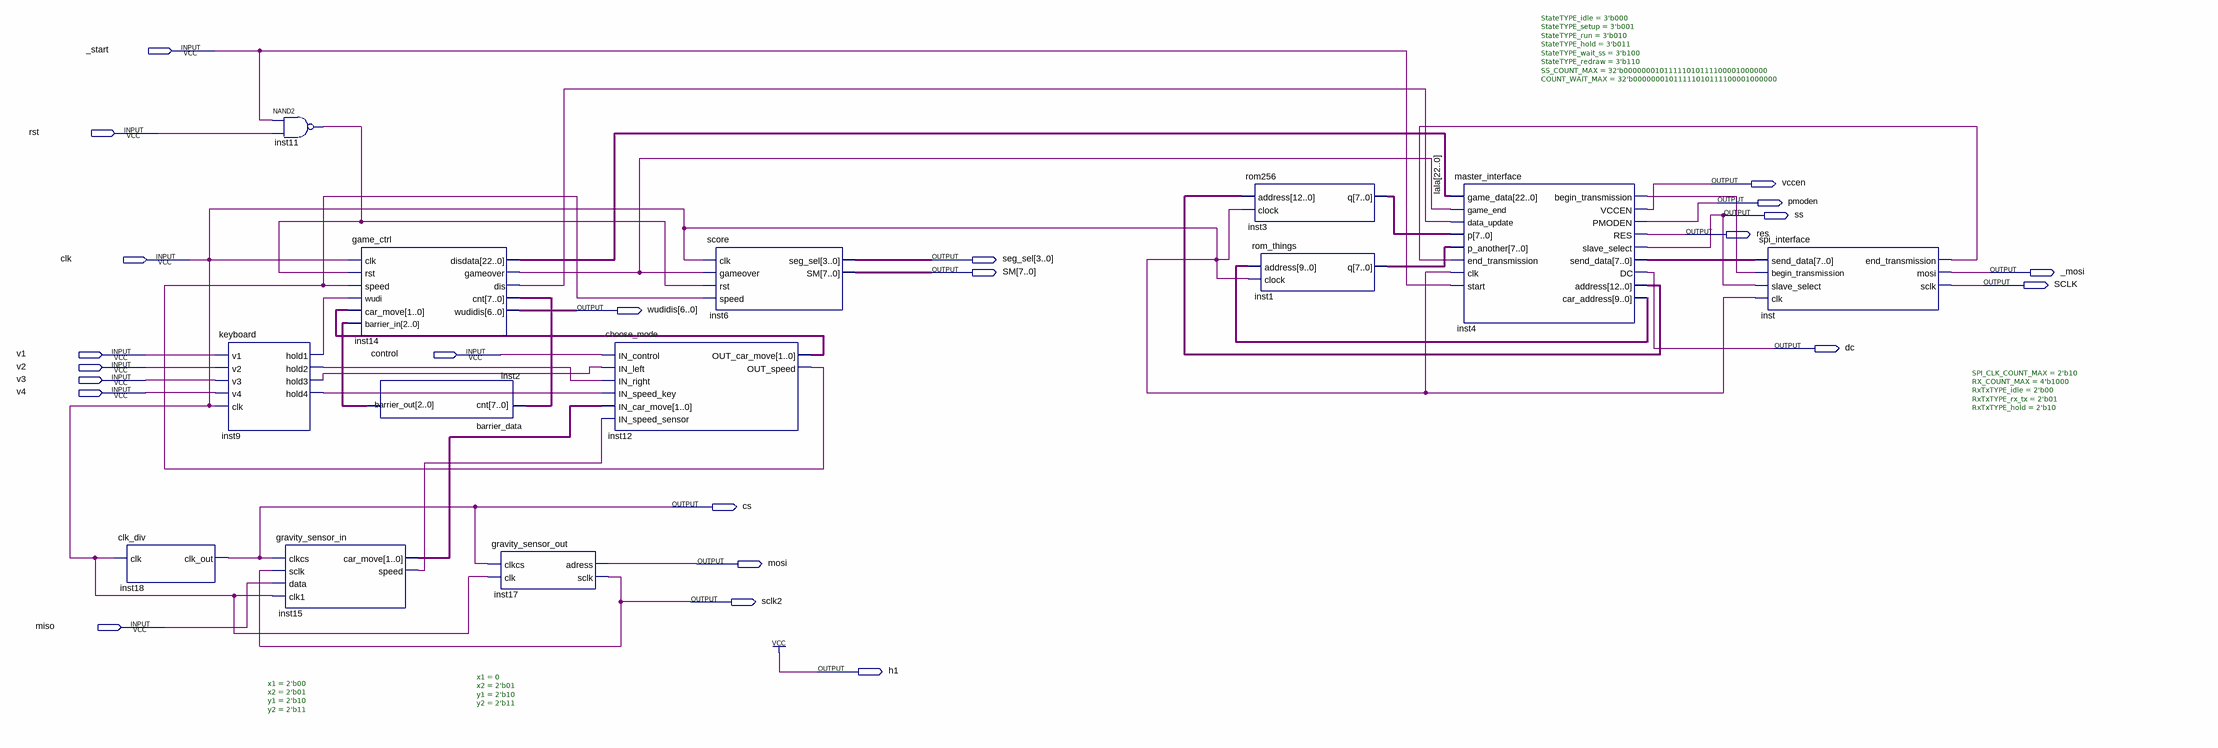
[diagram p0: schematic sheet]
// Quartus schematic mission3 (2).bdf as structural Verilog: 13 symbols, 23 pins
module \mission3_(2)  (
  input  _start,
  input  rst,
  input  clk,
  input  v1,
  input  control,
  input  v2,
  input  v3,
  input  v4,
  input  miso,
  output vccen,
  output pmoden,
  output ss,
  output res,
  output [3:0] seg_sel,
  output [7:0] SM,
  output _mosi,
  output SCLK,
  output [6:0] wudidis,
  output dc,
  output cs,
  output mosi,
  output sclk2,
  output h1
);

  wire inst4_begin_transmission, inst9_hold1, inst9_hold2, inst9_hold3, inst9_hold4, inst11_out,
       inst12_out_speed, inst14_dis, inst14_gameover, inst15_speed, inst_end_transmission;
  wire [1:0] inst12_out_car_move, inst15_car_move;
  wire [2:0] inst2_barrier_out;
  wire [7:0] inst1_q, inst3_q, inst4_send_data, inst14_cnt;
  wire [9:0] inst4_car_address;
  wire [12:0] inst4_address;
  wire [22:0] lala;

  clk_div inst18 (.clk(clk), .clk_out(cs));
  keyboard inst9 (
    .v1(v1), .v2(v2), .v3(v3), .v4(v4), .clk(clk), .hold1(inst9_hold1), .hold2(inst9_hold2),
    .hold3(inst9_hold3), .hold4(inst9_hold4));
  nand inst11 (inst11_out, _start, rst);
  gravity_sensor_in #(.x1(2'b00), .x2(2'b01), .y1(2'b10), .y2(2'b11)) inst15 (
    .clkcs(cs), .sclk(sclk2), .data(miso), .clk1(clk), .car_move(inst15_car_move), .speed(inst15_speed));
  game_ctrl inst14 (
    .clk(clk), .rst(inst11_out), .speed(inst12_out_speed), .wudi(inst9_hold1),
    .car_move(inst12_out_car_move), .barrier_in(inst2_barrier_out), .disdata(lala),
    .gameover(inst14_gameover), .dis(inst14_dis), .cnt(inst14_cnt), .wudidis(wudidis));
  barrier_data inst2 (.cnt(inst14_cnt), .barrier_out(inst2_barrier_out));
  gravity_sensor_out #(.x1(0), .x2(2'b01), .y1(2'b10), .y2(2'b11)) inst17 (
    .clkcs(cs), .clk(clk), .adress(mosi), .sclk(sclk2));
  choose_mode inst12 (
    .IN_control(control), .IN_left(inst9_hold3), .IN_right(inst9_hold2), .IN_speed_key(inst9_hold4),
    .IN_car_move(inst15_car_move), .IN_speed_sensor(inst15_speed), .OUT_car_move(inst12_out_car_move),
    .OUT_speed(inst12_out_speed));
  score inst6 (
    .clk(clk), .gameover(inst14_gameover), .rst(inst11_out), .speed(inst12_out_speed), .seg_sel(seg_sel),
    .SM(SM));
  rom256 inst3 (.address(inst4_address), .clock(clk), .q(inst3_q));
  rom_things inst1 (.address(inst4_car_address), .clock(clk), .q(inst1_q));
  master_interface #(.StateTYPE_idle(3'b000), .StateTYPE_setup(3'b001), .StateTYPE_run(3'b010), .StateTYPE_hold(3'b011), .StateTYPE_wait_ss(3'b100), .StateTYPE_redraw(3'b110), .SS_COUNT_MAX(32'b00000001011111010111100001000000), .COUNT_WAIT_MAX(32'b00000001011111010111100001000000)) inst4 (
    .game_data(lala), .game_end(inst14_gameover), .data_update(inst14_dis), .p(inst3_q), .p_another(inst1_q),
    .end_transmission(inst_end_transmission), .clk(clk), .start(_start),
    .begin_transmission(inst4_begin_transmission), .VCCEN(vccen), .PMODEN(pmoden), .RES(res),
    .slave_select(ss), .send_data(inst4_send_data), .DC(dc), .address(inst4_address),
    .car_address(inst4_car_address));
  spi_interface #(.SPI_CLK_COUNT_MAX(2'b10), .RX_COUNT_MAX(4'b1000), .RxTxTYPE_idle(2'b00), .RxTxTYPE_rx_tx(2'b01), .RxTxTYPE_hold(2'b10)) inst (
    .send_data(inst4_send_data), .begin_transmission(inst4_begin_transmission), .slave_select(ss), .clk(clk),
    .end_transmission(inst_end_transmission), .mosi(_mosi), .sclk(SCLK));

  assign h1 = 1'b1;
endmodule
